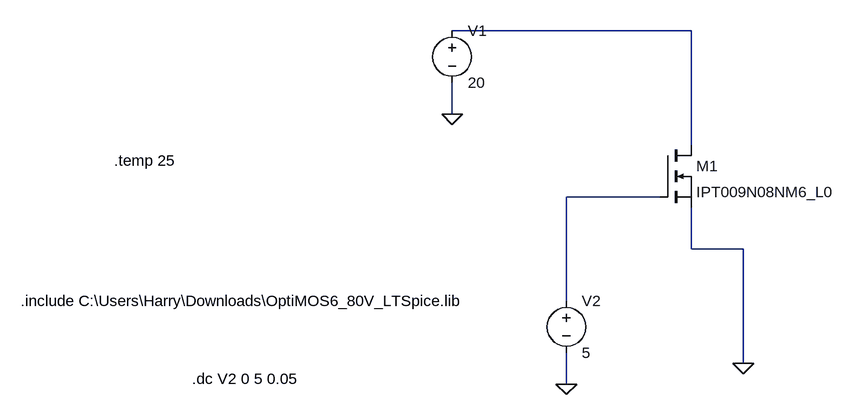
[diagram p0: schematic OptiMOS6_80V_LTSpice_validation.asc]
OptiMOS6_80V_LTSpice_validation.asc, the LTspice schematic file:
Version 4.1
SHEET 1 1288 680
WIRE -1200 -224 -1568 -224
WIRE -1568 -96 -1568 -144
WIRE -1200 -48 -1200 -224
WIRE -1248 32 -1392 32
WIRE -1200 112 -1200 48
WIRE -1120 112 -1200 112
WIRE -1392 192 -1392 32
WIRE -1120 288 -1120 112
WIRE -1392 320 -1392 272
FLAG -1120 288 0
FLAG -1392 320 0
FLAG -1568 -96 0
SYMBOL nmos -1248 -48 R0
SYMATTR InstName M1
SYMATTR Value IPT009N08NM6_L0
SYMATTR Prefix X
SYMBOL voltage -1568 -240 R0
WINDOW 123 0 0 Left 0
WINDOW 39 24 44 Left 2
SYMATTR InstName V1
SYMATTR Value 20
SYMBOL voltage -1392 176 R0
WINDOW 123 0 0 Left 0
WINDOW 39 0 0 Left 0
SYMATTR InstName V2
SYMATTR Value 5
TEXT -2232 192 Left 2 !.include C:\\Users\\Harry\\Downloads\\OptiMOS6_80V_LTSpice.lib
TEXT -1968 312 Left 2 !.dc V2 0 5 0.05
TEXT -2088 -24 Left 2 !.temp 25

The netlist it stands for:
* OptiMOS6_80V_LTSpice_validation.asc
X§M1 N001 N002 0 IPT009N08NM6_L0  ; pins D G S
V1 N001 0 20
V2 N002 0 5
.include C:\Users\Harry\Downloads\OptiMOS6_80V_LTSpice.lib
.dc V2 0 5 0.05
.temp 25
.backanno
.end